# Altium schematic sheet 06.SchDoc
size 420 x 297 mm
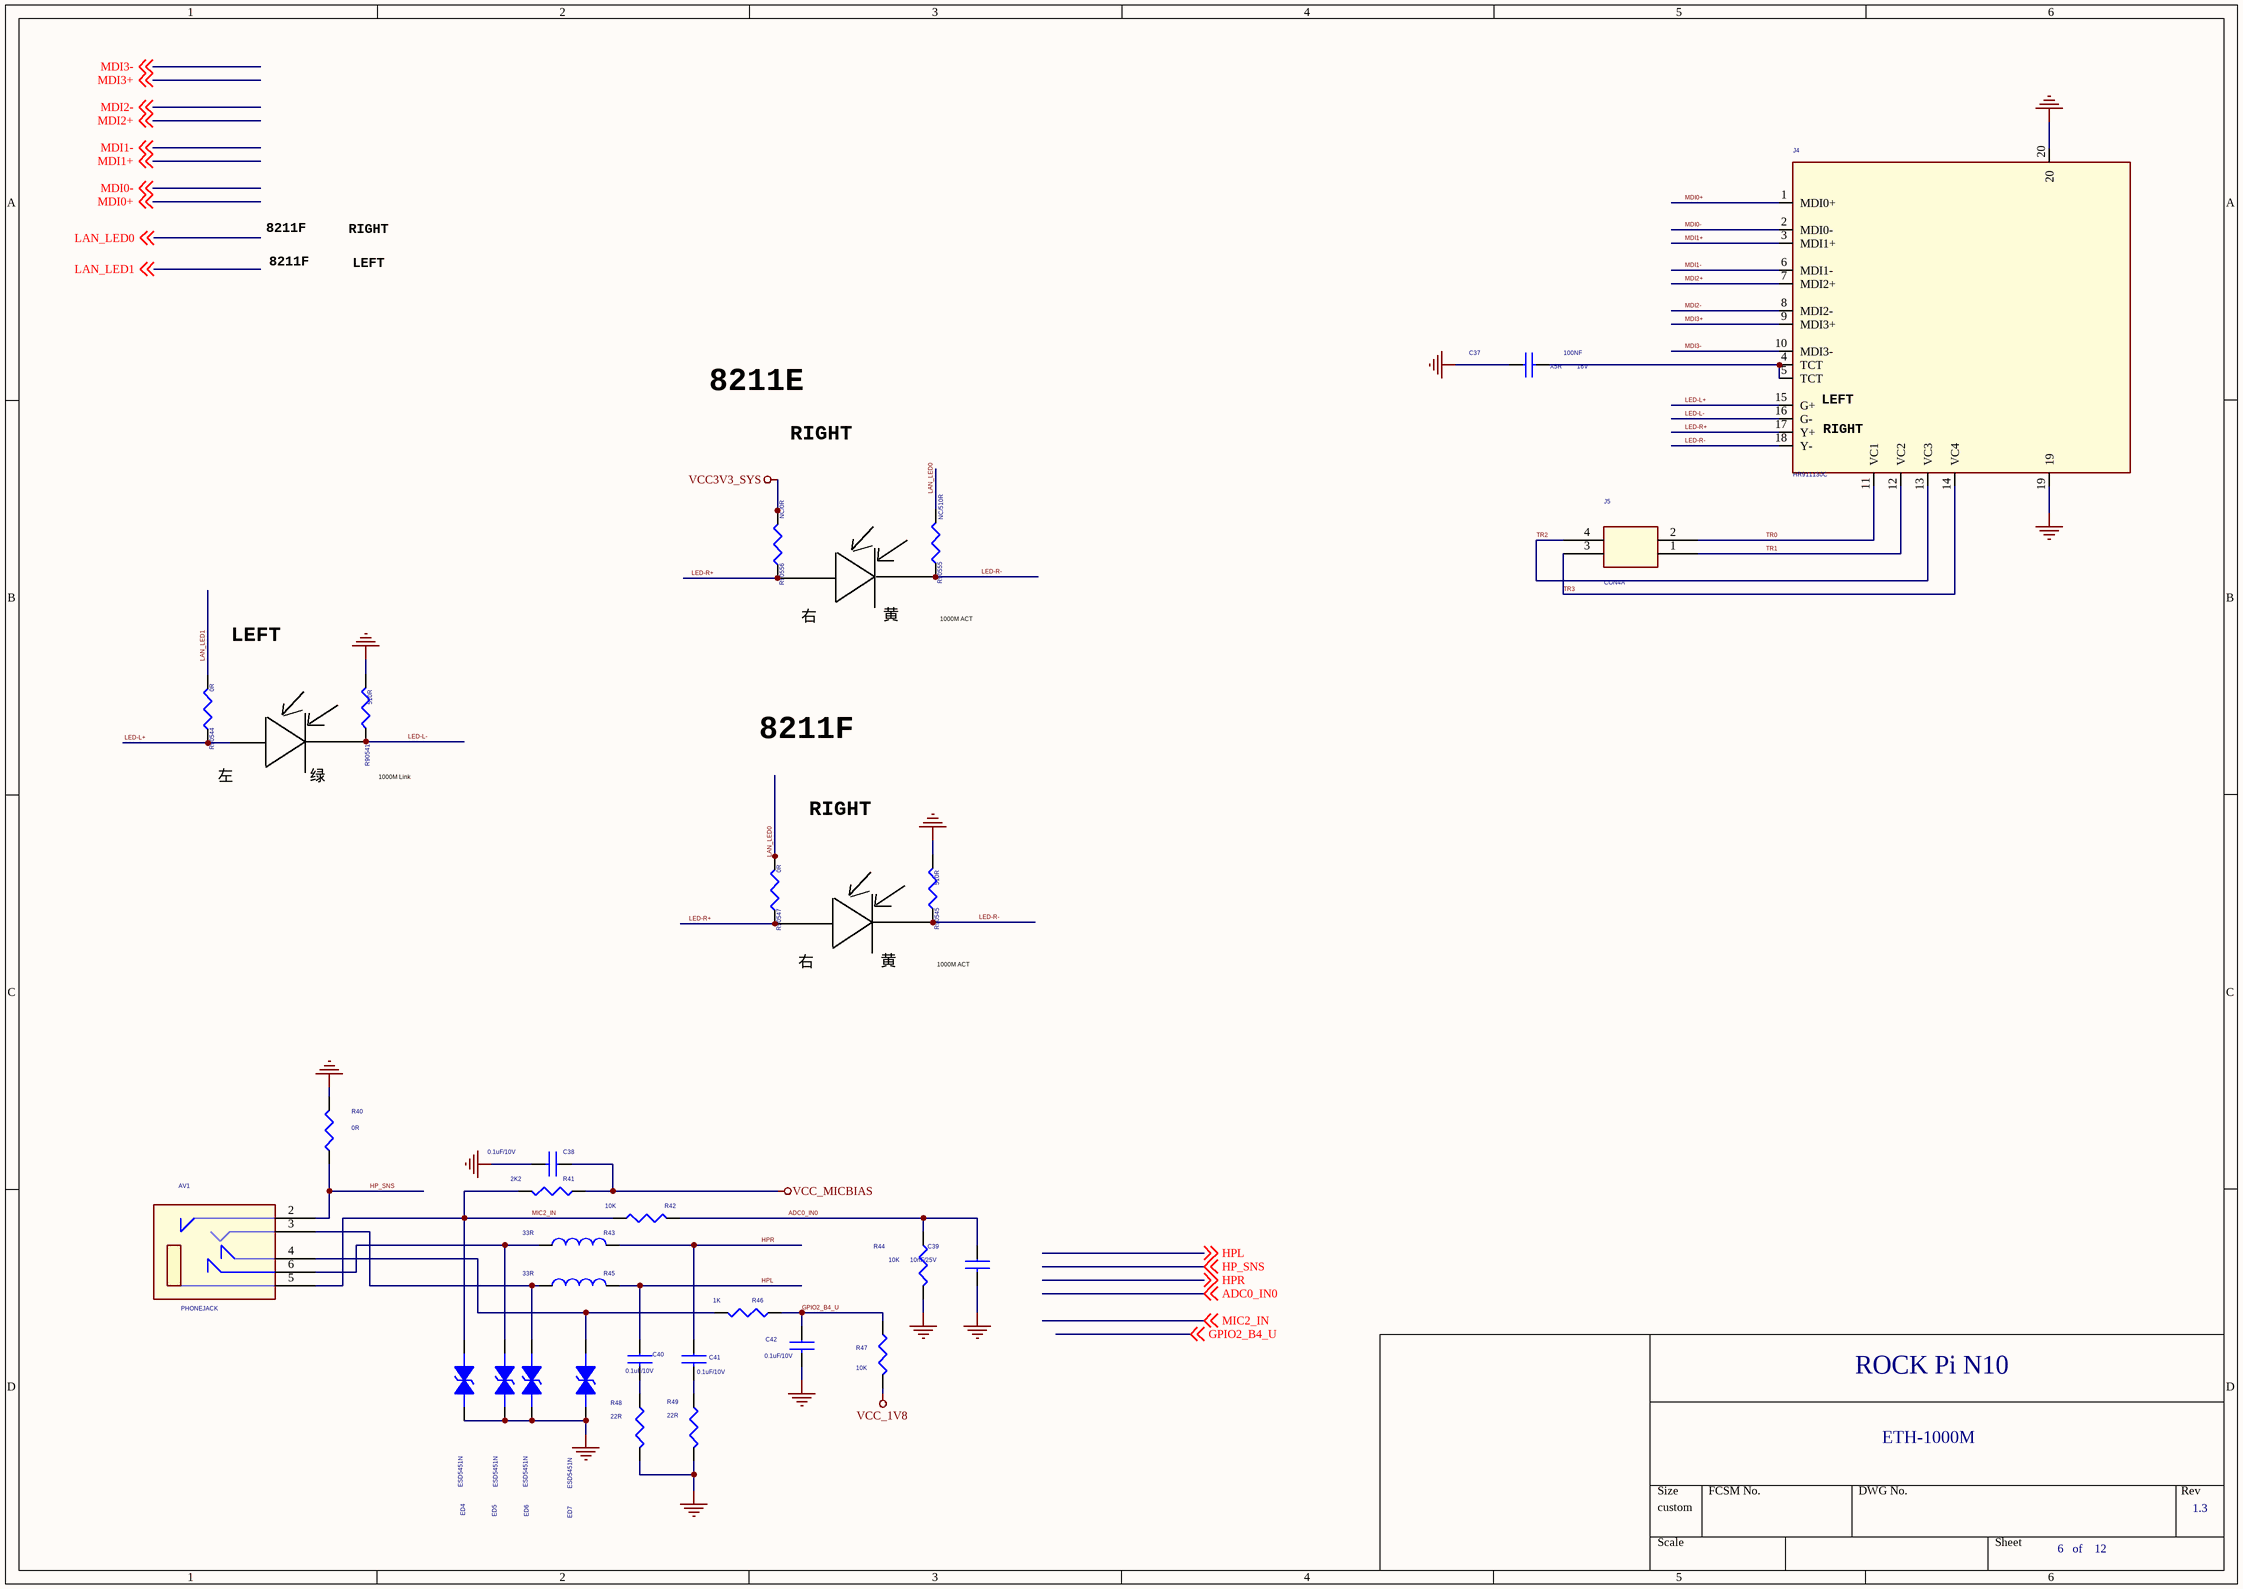
[diagram p0: 06.SchDoc]

## Parts
AV1  PHONEJACK  [PJ-327A]
C37  100NF  Dielectric: X5R  Voltage: 16V  [C0805]
C38  0.1uF/10V  [C0402]
C39  10nF/25V  [C0402]
C40  0.1uF/10V  [C0402]
C41  0.1uF/10V  [C0402]
C42  0.1uF/10V  [C0402]
ED4  ESD5451N  [E0402N]
ED5  ESD5451N  [E0402N]
ED6  ESD5451N  [E0402N]
ED7  ESD5451N  [E0402N]
J4  HR911130C  [RJ45_PULSE]
J5  CON4A  [DIP4-2.54MM-2X2_FX]
R40  0R  [R0402]
R41  2K2  [R0402]
R42  10K  [R0402]
R43  33R  [L0603]
R44  10K  [R0402]
R45  33R  [L0603]
R46  1K  [R0402]
R47  10K  [R0402]
R48  22R  [R0402]
R49  22R  [R0402]
R90541  510R  [R0402]
R90544  0R  [R0402]
R90545  510R  [R0402]
R90547  0R  [R0402]
R90555  NC/510R  [R0402]
R90556  NC/0R  [R0402]

## Nets
GND: C37.1 C38.2 C39.2 C42.2 ED4.2 ED5.2 ED6.2 ED7.2 J4.19 J4.20 R40.1 R44.1 R48.1 R49.1 R90541.2 R90545.2
VCC3V3_SYS: R90556.2
VCC_1V8: R47.1
VCC_MICBIAS: C38.1 R41.2
ADC0_IN0: C39.1 R42.1 R44.2 ; off-sheet ADC0_IN0
GPIO2_B4_U: C42.1 R46.2 R47.2 ; off-sheet GPIO2_B4_U
HP_SNS: AV1.2(DH) R40.2 ; off-sheet HP_SNS
HPL: C40.1 R45.2 ; off-sheet HPL
HPR: C41.1 R43.2 ; off-sheet HPR
LAN_LED0: R90547.2 R90555.2 ; off-sheet LAN_LED0
LAN_LED1: R90544.2 ; off-sheet LAN_LED1
LED-L+: J4.15(G+) R90544.1
LED-L-: J4.16(G-) R90541.1
LED-R+: J4.17(Y+) R90547.1 R90556.1
LED-R-: J4.18(Y-) R90545.1 R90555.1
MDI0+: J4.1(MDI0+) ; off-sheet MDI0+
MDI0-: J4.2(MDI0-) ; off-sheet MDI0-
MDI1+: J4.3(MDI1+) ; off-sheet MDI1+
MDI1-: J4.6(MDI1-) ; off-sheet MDI1-
MDI2+: J4.7(MDI2+) ; off-sheet MDI2+
MDI2-: J4.8(MDI2-) ; off-sheet MDI2-
MDI3+: J4.9(MDI3+) ; off-sheet MDI3+
MDI3-: J4.10(MDI3-) ; off-sheet MDI3-
MIC2_IN: AV1.5(D) ED4.1 R41.1 R42.2 ; off-sheet MIC2_IN
TR0: J4.11(VC1) J5.2
TR1: J4.12(VC2) J5.1
TR2: J4.13(VC3) J5.4
TR3: J4.14(VC4) J5.3
NetAV1_3: AV1.3(R) ED6.1 R45.1
NetAV1_4: AV1.4(L) ED7.1 R46.1
NetAV1_6: AV1.6(HP) ED5.1 R43.1
NetC37_2: C37.2 J4.4(TCT) J4.5(TCT)
NetC40_2: C40.2 R48.2
NetC41_2: C41.2 R49.2

## Notes on the sheet
- 8211F
- RIGHT
- LEFT
- 8211E
- (near J4) LEFT
- (near J4) RIGHT
- (near R90544) LEFT
- (near R90556) 右
- 黄
- 1000M ACT
- (near R90544) 左
- 绿
- (near R90541) 1000M Link
- (near R90547) 右
- ROCK Pi N10
- ETH-1000M
- 1.3
- 6   of    12

## Library data of the parts
AV1 = PHONEJACK STEREO SW_3: 耳插; BOM_VALUE: 0; BOM_TYPE: 60
C37 = CAP NP_2: cap,100.00nF,+/-10%,16V,X5R,C0402; Manufacturer PN: C1005X5R1C104K050BA; Manufacturer: TDK; Tolerance: 10%; Priority: A; Created by: JJJ; Part Type: C0402; RK PN: C1005X5R1C104K050BA
C38 C40-C42 = CAP: RoHS CHIP CAP 0.1uF +10/-10% X7R
C39 = CAP: RoHS CHIP CAP 0.01uF +10/-10% X7R
ED4-ED7 = TVS: ESD Component,5V,30P,SMD,0402
J4 = HR911130C_0: 千兆网口接口，内置变压器; VAL: J00-0061; DESIG: 10/100 base TX LXT971A; BOI: RJ45; FAB: PULSE; DEV: CON_PULSE_J00-61; Priority: A; REF: J00-0061; Created by: JJJ; Manufacturer Part Number: HR911130C; Part Type: Ethernet Jack; RK PN: HR911130C
J5 = CON4A_0
R40 R42 R44 = RESISTOR: ROHS CHIP RES 0R 1/16W 5%
R41 = RESISTOR: ROHS CHIP RES 2K2 1/16W 5%
R43 R45 = INDUCTOR: ROHS CHIP RES 33R 1/16W 5%
R46 R47 = RESISTOR: ROHS CHIP RES 1K 1/16W 5%
R48 R49 = RESISTOR: ROHS CHIP RES 22R 1/16W 5%
R90541 R90544 R90547 R90555 R90556 = RESISTOR_2: 通用厚膜电阻,4K7,+/-5%,R0402,1/16W.; Manufacturer: YAGEO; Tolerance: 5%; RK PN: RC0402JR-074K7L; Priority: A; Wattage: 1/16W; Part Type: 通用厚膜电阻; Manufacturer PN: RC0402JR-074K7L; Created by: YTL
R90545 = RESISTOR_2: 通用厚膜电阻,4K7,+/-5%,R0402,1/16W.; Manufacturer PN: RC0402JR-074K7L; Manufacturer: YAGEO; Tolerance: 5%; Wattage: 1/16W; Priority: A; Created by: YTL; Part Type: 通用厚膜电阻; RK PN: RC0402JR-074K7L